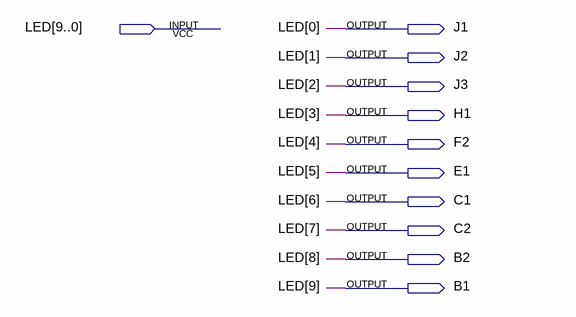
[diagram p0: schematic sheet]
// Quartus schematic Led.bdf as structural Verilog: 0 symbols, 11 pins
module Led (
  input  [9:0] LED,
  output J1,
  output J2,
  output J3,
  output H1,
  output F2,
  output E1,
  output C1,
  output C2,
  output B2,
  output B1
);


  assign B1 = LED[9];
  assign B2 = LED[8];
  assign C1 = LED[6];
  assign C2 = LED[7];
  assign E1 = LED[5];
  assign F2 = LED[4];
  assign H1 = LED[3];
  assign J1 = LED[0];
  assign J2 = LED[1];
  assign J3 = LED[2];
endmodule
